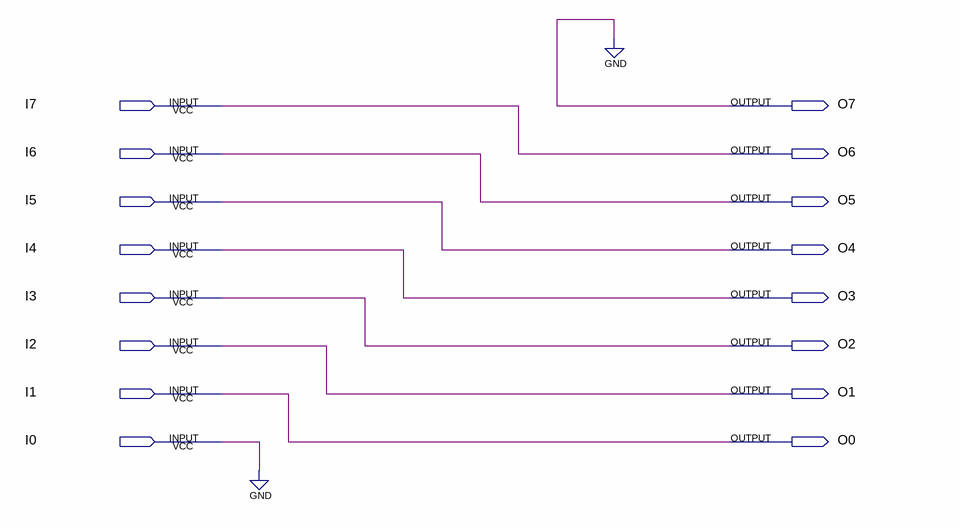
[diagram p0: schematic sheet]
// Quartus schematic RS_1BIT.bdf as structural Verilog: 0 symbols, 16 pins
module RS_1BIT (
  input  I7,
  input  I6,
  input  I5,
  input  I4,
  input  I3,
  input  I2,
  input  I1,
  input  I0,
  output O7,
  output O6,
  output O5,
  output O4,
  output O3,
  output O2,
  output O1,
  output O0
);


  assign O0 = I1;
  assign O1 = I2;
  assign O2 = I3;
  assign O3 = I4;
  assign O4 = I5;
  assign O5 = I6;
  assign O6 = I7;
  assign O7 = 1'b0;
  // also tied to GND on the sheet: I0
endmodule
